# Altium schematic sheet 1_Power.SchDoc
size A; SheetNumber: 2; SheetTotal: 4
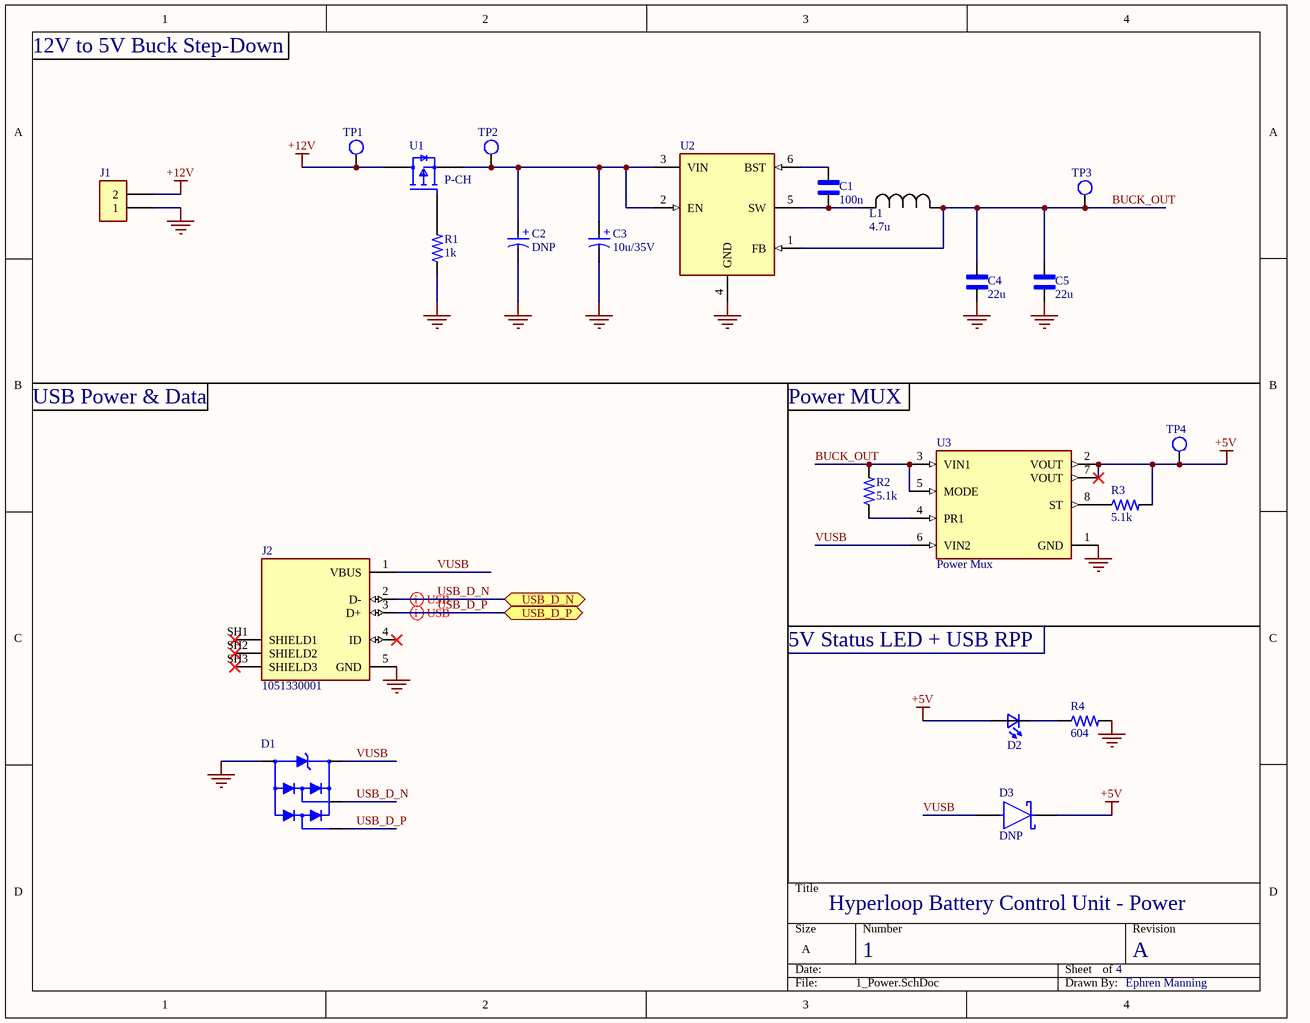
[diagram p0: 1_Power.SchDoc]

## Parts
C1  100n  [CAP_0603-Footprint]
C2  DNP  [WCAP-AS5H_D5H5.5]
C3  10u/35V  [WCAP-AS5H_D5H5.5]
C4  22u  [CAP_0603-Footprint]
C5  22u  [CAP_0603-Footprint]
D1  PRTR5V0U2X,215  [SOT143B]  (value not drawn)
D2  LTST-C191KGKT  [LED_0603-Footprint-1]  (value not drawn)
D3  DNP  [FP-SOD123W-MFG]
J1  282837-2  [TE_282837-2]  (value not drawn)
J2  1051330001  [MOLEX_1051330001]
L1  4.7u  [IND_SRP0412-1R0K_BRN]
R1  1k  [RES_0603-Footprint-1]
R2  5.1k  [RES_0603-Footprint-1]
R3  5.1k  [RES_0603-Footprint-1]
R4  604  [RES_0603-Footprint-1]
TP1  PTH Test Point  [PTH Test Point-Footprint-1]  (value not drawn)
TP2  PTH Test Point  [PTH Test Point-Footprint-1]  (value not drawn)
TP3  PTH Test Point  [PTH Test Point-Footprint-1]  (value not drawn)
TP4  PTH Test Point  [PTH Test Point-Footprint-1]  (value not drawn)
U1  P-CH  [SOT95P242X110-3N]
U2  AP63205WU-7  [FP-TSOT26-MFG]  (value not drawn)
U3  Power Mux  [SOTFL50P160X60-8N]

## Ports
USB_D_N (bidir, see 0_Overview[2B], 2_MCU[1A]), USB_D_P (bidir, see 0_Overview[2B], 2_MCU[1A])

## Nets
+5V: D2.2(A2) D3.1 R3.2 TP4.1 U3.2(VOUT) U3.7(VOUT)
+12V: J1.2 TP1.1 U1.3(Drain)
GND: C2.2(N) C3.2(N) C4.1 C5.1 D1.1(P$1) J1.1 J2.5(GND) R1.1 R4.2 U2.4(GND) U3.1(GND)
BUCK_OUT: C4.2 C5.2 L1.1 R2.2 TP3.1 U2.1(FB) U3.3(VIN1) U3.5(MODE)
USB_D_N: D1.2(P$2) J2.2(D-) ; port USB_D_N
USB_D_P: D1.3(P$3) J2.3(D+) ; port USB_D_P
VUSB: D1.4(P$4) D3.2 J2.1(VBUS) U3.6(VIN2)
NetC1_1: C1.1 L1.2 U2.5(SW)
NetC1_2: C1.2 U2.6(BST)
NetC2_1: C2.1(P) C3.1(P) TP2.1 U1.2(Source) U2.2(EN) U2.3(VIN)
NetD2_1: D2.1(K2) R4.1
NetR1_2: R1.2 U1.1(Gate)
NetR2_1: R2.1 U3.4(PR1)
NetR3_1: R3.1 U3.8(ST)

Not connected (* = marked no-connect by the designer): J2 4(ID)* SH1(SHIELD1)* SH2(SHIELD2)* SH3(SHIELD3)*

## Layout directives
differential pair: USB_D_N, USB_D_P

## Notes on the sheet
- 12V to 5V Buck Step-Down
- USB Power & Data
- Power MUX
- 5V Status LED + USB RPP
- Hyperloop Battery Control Unit - Power
- 1
- 4
- A
- Ephren Manning
- (in symbol CMP-00028-2) +

## Library data of the parts
C1 = CMP-00029-2: 100nF/16V ±10% Ceramic 0603; Manufacturer Part Number 1: CL10B104KO8NNNC; Manufacturer 1: Samsung Electro-Mechanics
C2 C3 = CMP-00028-2: ALUM 10uF 20% 35V SMD; Manufacturer 1: Würth Elektronik; Manufacturer Part Number 1: 865230542002
C4 C5 = CMP-00030-1: 22uF/10V CER 0603; Manufacturer Part Number 1: CL10A226MP8NUNE; Manufacturer 1: Samsung Electro-Mechanics
D1 = CMP-018-000000-4: Diode Array, ESD; Manufacturer 1: Nexperia USA Inc.; Manufacturer Part Number 1: PRTR5V0U2X,215
D2 = CMP-038-000000-5: Green 571nm LED Indication - Discrete 2V 0603 (1608 Metric); Manufacturer 1: Lite-On Inc.; Manufacturer Part Number 1: LTST-C191KGKT
D3 = CMP-00005-2: DIODE SCHOTTKY 60V 2A SOD123; RoHS Compliant: Yes
J1 = CMP-079-000000-3: 2x Screw Terminal; Manufacturer 1: TE Connectivity; Manufacturer Part Number 1: 282837-2
J2 = CMP-016-000000-5: Micro USB Type B 90 Degree Conn; Manufacturer 1: Molex; Manufacturer Part Number 1: 1051330001
L1 = CMP-007-000000-4: 4.7 uH 2.8A Inductor; Manufacturer 1: Bourns Electronics; Manufacturer Part Number 1: SRP0415-4R7K
R1 = CMP-00039-1: 1k 1% 0.1W 0603; Manufacturer 1: YAGEO; Manufacturer Part Number 1: RC0603FR-071KL
R2 R3 = CMP-028-000000-5: 5.1k Ohms ±1% 0.1W 0603; Manufacturer Part Number 1: RC0603FR-075K1L; Manufacturer 1: Yageo
R4 = CMP-00040-1: 604 Ohm 1% 1/10 W 0603; Manufacturer Part Number 1: RC0603FR-07604RL; Manufacturer 1: YAGEO
TP1-TP4 = CMP-00011-2: Plated through-hole test point to allow soldering in pin headers.
U1 = CMP-00025-1: Mosfet P-CH 30V 3.8A Vgs(ON) = -10V SOT23; Manufacturer 1: Diodes Incorporated; Manufacturer Part Number 1: DMP3099L-7
U2 = CMP-00003-3: AP63205 Series 32 V 2 A 1.1 MHz Synchronous Buck Converter -TSOT-26
U3 = CMP-064-000000-3: TPS2116, Power Mux, 1.6V to 5.5V, 2.5A, SOT-583; Manufacturer 1: Texas Instruments; Manufacturer Part Number 1: TPS2116DRLR; Package: SOT-583